# EasyEDA schematic Dashlight.json
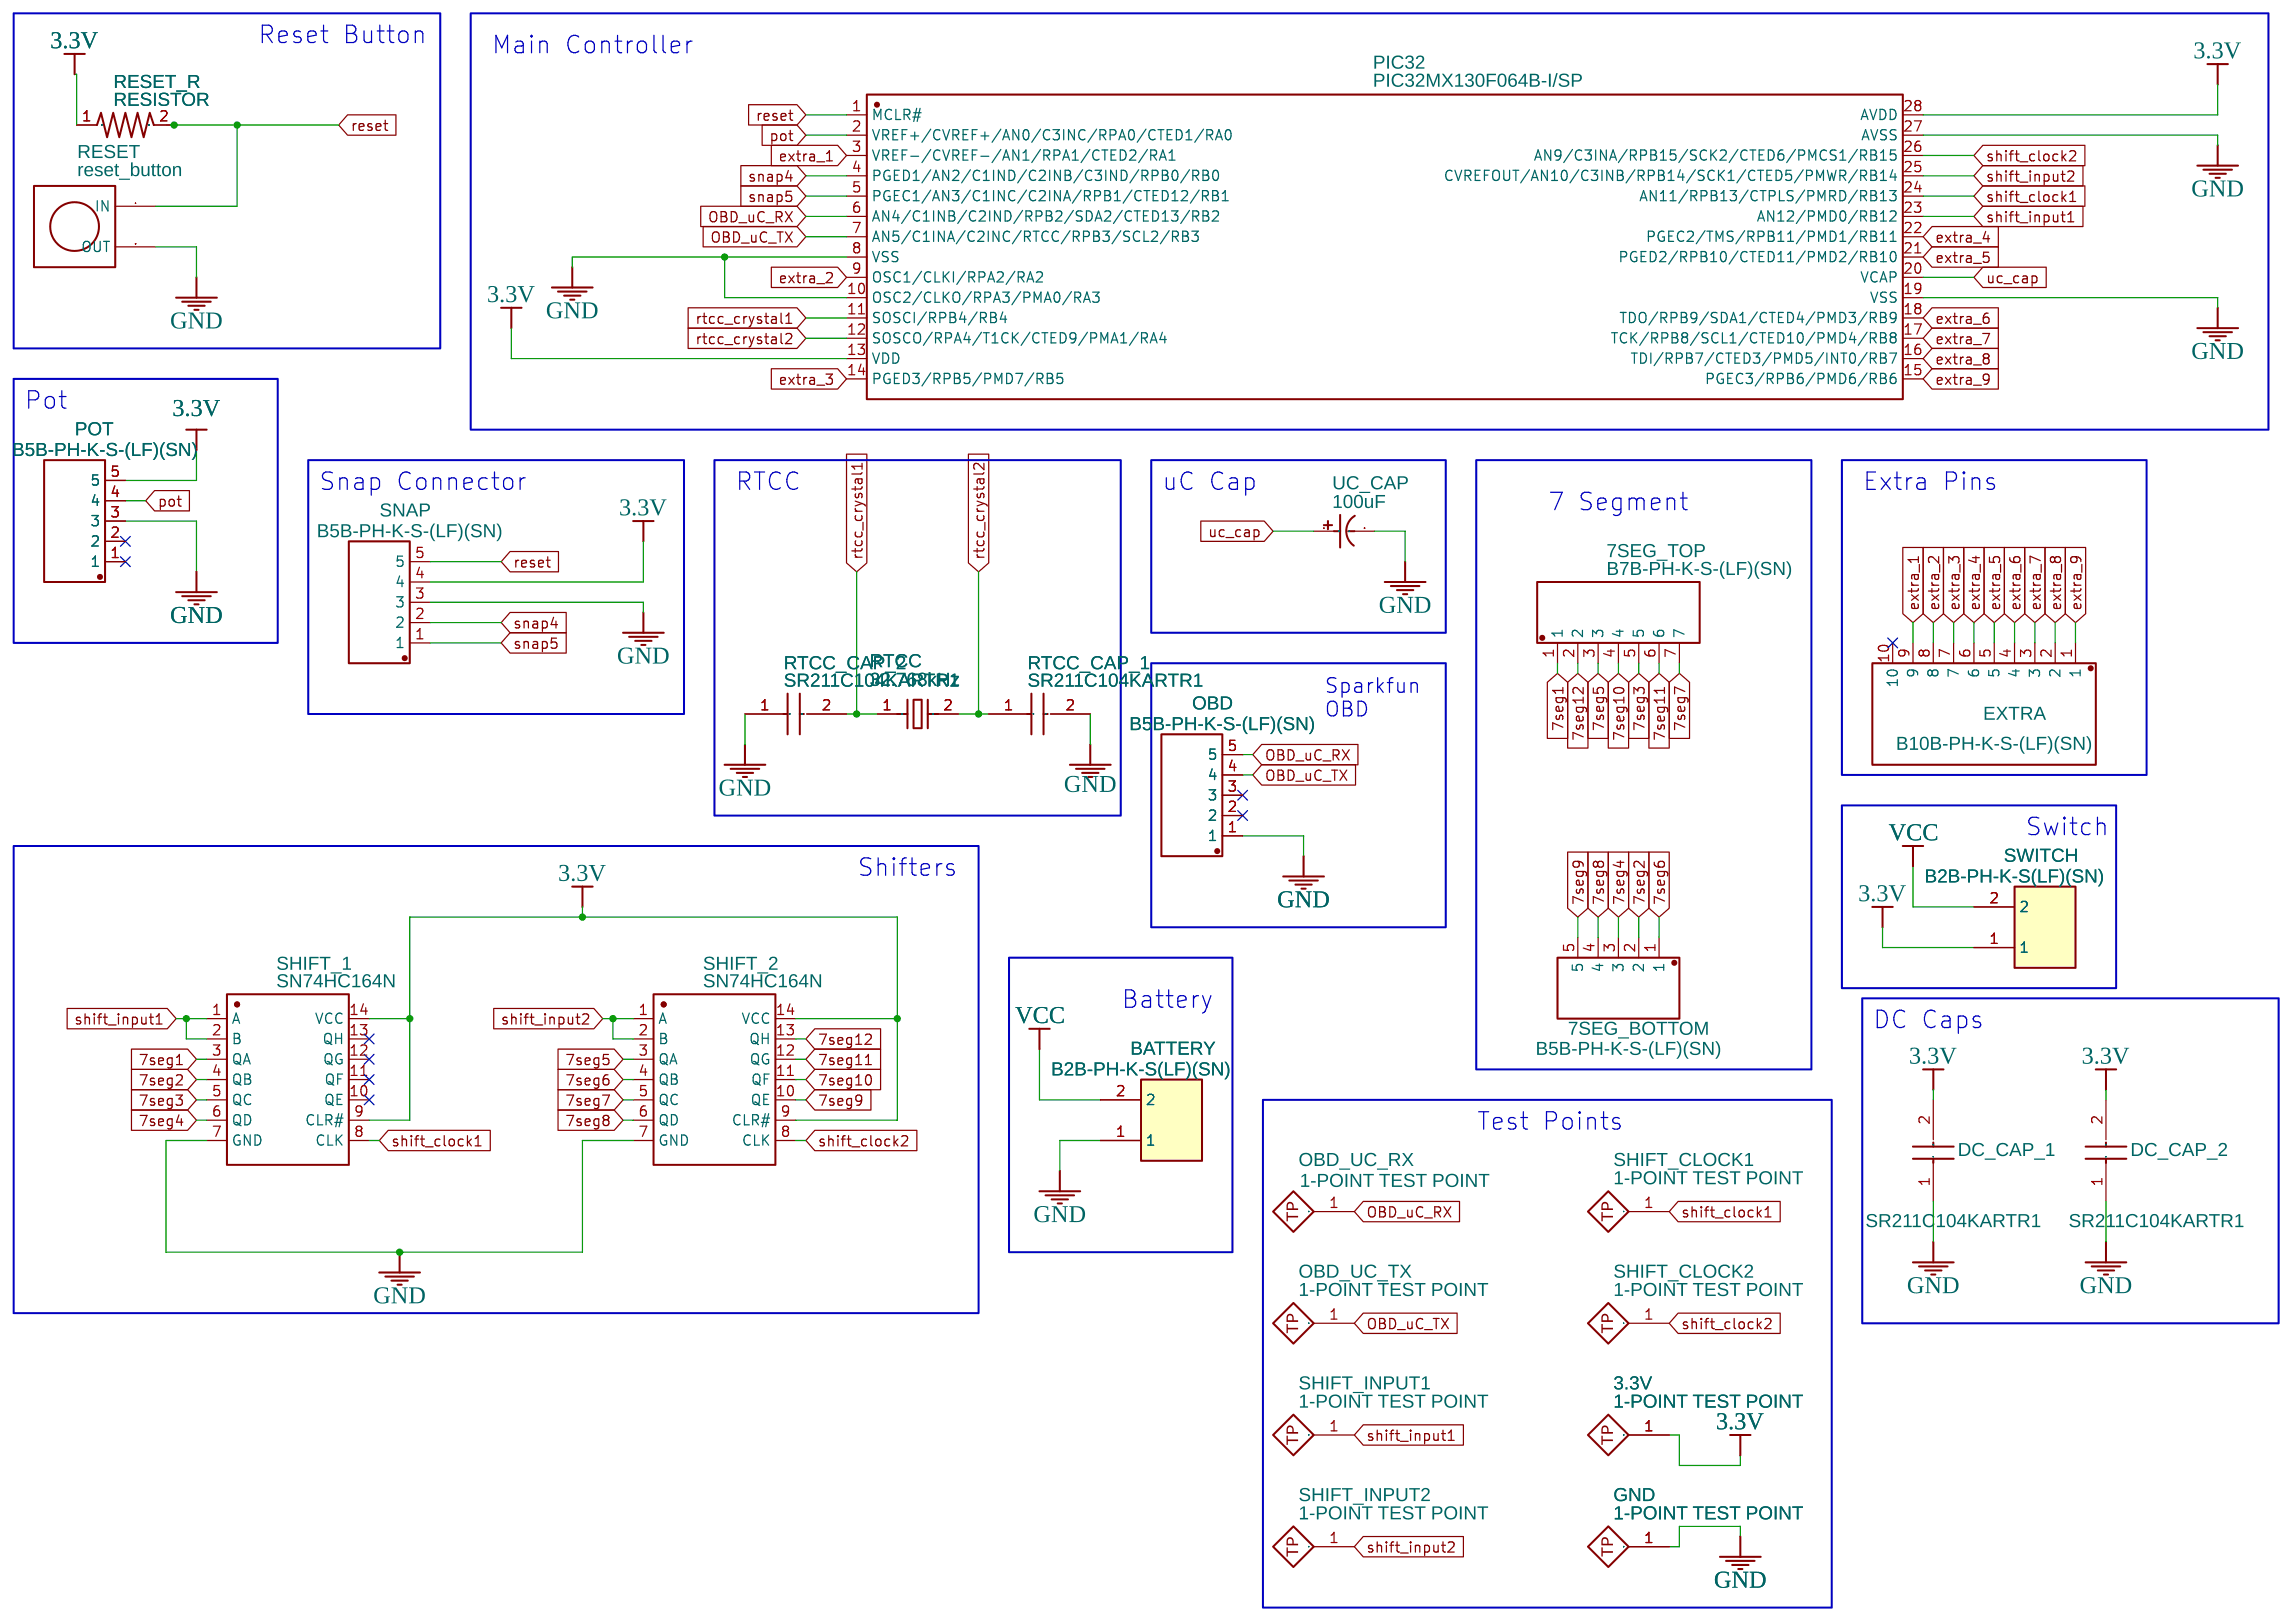
[diagram p0: schematic sheet]

## Parts
3.3V  1-POINT TEST POINT  [1-POINT_TEST-POINT]
7SEG_BOTTOM  B5B-PH-K-S-(LF)(SN)  [CONN-TH_B5B-PH-K-S-LF-SN]
7SEG_TOP  B7B-PH-K-S-(LF)(SN)  [CONN-TH_B7B-PH-K-S-LF-SN]
BATTERY  B2B-PH-K-S(LF)(SN)  [CONN-TH_B2B-PH-K-S]
DC_CAP_1  SR211C104KARTR1  [SR211C104KARTR1]
DC_CAP_2  SR211C104KARTR1  [SR211C104KARTR1]
EXTRA  B10B-PH-K-S-(LF)(SN)  [CONN-TH_B10B-PH-K-S-LF-SN]
GND  1-POINT TEST POINT  [1-POINT_TEST-POINT]
OBD  B5B-PH-K-S-(LF)(SN)  [CONN-TH_B5B-PH-K-S-LF-SN]
OBD_UC_RX  1-POINT TEST POINT  [1-POINT_TEST-POINT]
OBD_UC_TX  1-POINT TEST POINT  [1-POINT_TEST-POINT]
PIC32  PIC32MX130F064B-I/SP  [SPDIP-28_L34.7-W7.2-P2.54-LS7.9-BL]
POT  B5B-PH-K-S-(LF)(SN)  [CONN-TH_B5B-PH-K-S-LF-SN]
RESET  reset_button  [THROUGH-HOLE 6X6MM PUSH BUTTON]
RESET_R  RESISTOR  [RESISTOR THROUGH-HOLE]
RTCC  32.768kHz  [CRYSTAL-TH_BD3.1-L8.0-P1.10-D0.3]
RTCC_CAP_1  SR211C104KARTR1  [SR211C104KARTR1]
RTCC_CAP_2  SR211C104KARTR1  [SR211C104KARTR1]
SHIFT_1  SN74HC164N  [DIP-14_L20.0-W7.6-P2.54-LS8.0-BL]
SHIFT_2  SN74HC164N  [DIP-14_L20.0-W7.6-P2.54-LS8.0-BL]
SHIFT_CLOCK1  1-POINT TEST POINT  [1-POINT_TEST-POINT]
SHIFT_CLOCK2  1-POINT TEST POINT  [1-POINT_TEST-POINT]
SHIFT_INPUT1  1-POINT TEST POINT  [1-POINT_TEST-POINT]
SHIFT_INPUT2  1-POINT TEST POINT  [1-POINT_TEST-POINT]
SNAP  B5B-PH-K-S-(LF)(SN)  [CONN-TH_B5B-PH-K-S-LF-SN]
SWITCH  B2B-PH-K-S(LF)(SN)  [CONN-TH_B2B-PH-K-S]
UC_CAP  100uF  [100UF (THROUGH HOLE) CP]

## Library data of the parts
3.3V GND OBD_UC_RX OBD_UC_TX SHIFT_CLOCK1 SHIFT_CLOCK2 SHIFT_INPUT1 SHIFT_INPUT2 = 1-POINT TEST POINT: Contributor: ahsan2
7SEG_BOTTOM OBD POT SNAP = B5B-PH-K-S-(LF)(SN): Contributor: LCSC; Supplier: LCSC; Supplier Part: C157993; Manufacturer: JST; Manufacturer Part: B5B-PH-K-S(LF)(SN); JLCPCB Part Class: Extended Part
7SEG_TOP = B7B-PH-K-S-(LF)(SN): Contributor: LCSC; Supplier: LCSC; Supplier Part: C157981; Manufacturer: JST; Manufacturer Part: B7B-PH-K-S(LF)(SN); JLCPCB Part Class: Extended Part
BATTERY SWITCH = B2B-PH-K-S(LF)(SN): Contributor: LCSC; Supplier: LCSC; Manufacturer: JST; Supplier Part: C131337; JLCPCB Part Class: Extended Part
DC_CAP_1 DC_CAP_2 RTCC_CAP_1 RTCC_CAP_2 = SR211C104KARTR1: Contributor: prestigeJ
EXTRA = B10B-PH-K-S-(LF)(SN): Contributor: LCSC; Supplier: LCSC; Supplier Part: C158038; Manufacturer: JST; Manufacturer Part: B10B-PH-K-S(LF)(SN); JLCPCB Part Class: Extended Part
PIC32 = PIC32MX130F064B-I/SP: Contributor: LCSC; Supplier: LCSC; Supplier Part: C643652; Manufacturer: Microchip Tech; JLCPCB Part Class: Extended Part
RESET = Through-Hole 6x6mm Push Button: Contributor: barreraa1599; Convert to PCB: Yes; Add into BOM: Yes
RESET_R = res: Contributor: Saepul Hidayat
RTCC = MP4032K76812002: Supplier: LCSC; Supplier Part: C17702402; Manufacturer: HUAXIN(华昕); Manufacturer Part: MP2032K76812002; Contributor: lcsc
SHIFT_1 SHIFT_2 = SN74HC164N: Supplier: LCSC; Manufacturer: TI(德州仪器); Supplier Part: C2908; JLCPCB Part Class: Extended Part
UC_CAP = 100uF: Voltage: 10V; Supplier Part: C43314; Supplier: LCSC; Manufacturer: LCSC; Manufacturer Part: 100uF 10V 4*7

## Nets
3.3V: 3.3V.1 DC_CAP_1.2 DC_CAP_2.2 PIC32.13(VDD) PIC32.28(AVDD) POT.5 RESET_R.1 SHIFT_1.9(CLR#) SHIFT_1.14(VCC) SHIFT_2.9(CLR#) SHIFT_2.14(VCC) SNAP.4 SWITCH.1
GND: BATTERY.1 DC_CAP_1.1 DC_CAP_2.1 GND.1 OBD.1 PIC32.8(VSS) PIC32.10(OSC2/CLKO/RPA3/PMA0/RA3) PIC32.19(VSS) PIC32.27(AVSS) POT.3 RESET.2(OUT) RTCC_CAP_1.2 RTCC_CAP_2.1 SHIFT_1.7(GND) SHIFT_2.7(GND) SNAP.3 UC_CAP.2
VCC: BATTERY.2 SWITCH.2
7seg1: 7SEG_TOP.1 SHIFT_1.3(QA)
7seg2: 7SEG_BOTTOM.2 SHIFT_1.4(QB)
7seg3: 7SEG_TOP.5 SHIFT_1.5(QC)
7seg4: 7SEG_BOTTOM.3 SHIFT_1.6(QD)
7seg5: 7SEG_TOP.3 SHIFT_2.3(QA)
7seg6: 7SEG_BOTTOM.1 SHIFT_2.4(QB)
7seg7: 7SEG_TOP.7 SHIFT_2.5(QC)
7seg8: 7SEG_BOTTOM.4 SHIFT_2.6(QD)
7seg9: 7SEG_BOTTOM.5 SHIFT_2.10(QE)
7seg10: 7SEG_TOP.4 SHIFT_2.11(QF)
7seg11: 7SEG_TOP.6 SHIFT_2.12(QG)
7seg12: 7SEG_TOP.2 SHIFT_2.13(QH)
extra_1: EXTRA.9 PIC32.3(VREF-/CVREF-/AN1/RPA1/CTED2/RA1)
extra_2: EXTRA.8 PIC32.9(OSC1/CLKI/RPA2/RA2)
extra_3: EXTRA.7 PIC32.14(PGED3/RPB5/PMD7/RB5)
extra_4: EXTRA.6 PIC32.22(PGEC2/TMS/RPB11/PMD1/RB11)
extra_5: EXTRA.5 PIC32.21(PGED2/RPB10/CTED11/PMD2/RB10)
extra_6: EXTRA.4 PIC32.18(TDO/RPB9/SDA1/CTED4/PMD3/RB9)
extra_7: EXTRA.3 PIC32.17(TCK/RPB8/SCL1/CTED10/PMD4/RB8)
extra_8: EXTRA.2 PIC32.16(TDI/RPB7/CTED3/PMD5/INT0/RB7)
extra_9: EXTRA.1 PIC32.15(PGEC3/RPB6/PMD6/RB6)
OBD_uC_RX: OBD.5 OBD_UC_RX.1 PIC32.6(AN4/C1INB/C2IND/RPB2/SDA2/CTED13/RB2)
OBD_uC_TX: OBD.4 OBD_UC_TX.1 PIC32.7(AN5/C1INA/C2INC/RTCC/RPB3/SCL2/RB3)
pot: PIC32.2(VREF+/CVREF+/AN0/C3INC/RPA0/CTED1/RA0) POT.4
reset: PIC32.1(MCLR#) RESET.1(IN) RESET_R.2 SNAP.5
rtcc_crystal1: PIC32.11(SOSCI/RPB4/RB4) RTCC.1 RTCC_CAP_2.2
rtcc_crystal2: PIC32.12(SOSCO/RPA4/T1CK/CTED9/PMA1/RA4) RTCC.2 RTCC_CAP_1.1
shift_clock1: PIC32.24(AN11/RPB13/CTPLS/PMRD/RB13) SHIFT_1.8(CLK) SHIFT_CLOCK1.1
shift_clock2: PIC32.26(AN9/C3INA/RPB15/SCK2/CTED6/PMCS1/RB15) SHIFT_2.8(CLK) SHIFT_CLOCK2.1
shift_input1: PIC32.23(AN12/PMD0/RB12) SHIFT_1.1(A) SHIFT_1.2(B) SHIFT_INPUT1.1
shift_input2: PIC32.25(CVREFOUT/AN10/C3INB/RPB14/SCK1/CTED5/PMWR/RB14) SHIFT_2.1(A) SHIFT_2.2(B) SHIFT_INPUT2.1
snap4: PIC32.4(PGED1/AN2/C1IND/C2INB/C3IND/RPB0/RB0) SNAP.2
snap5: PIC32.5(PGEC1/AN3/C1INC/C2INA/RPB1/CTED12/RB1) SNAP.1
uc_cap: PIC32.20(VCAP) UC_CAP.1

Not connected (* = marked no-connect by the designer): EXTRA 10*; OBD 2* 3*; POT 1* 2*; SHIFT_1 10(QE)* 11(QF)* 12(QG)* 13(QH)*

## Notes on the sheet
- Reset Button
- Main Controller
- Pot
- Snap Connector
- RTCC
- uC Cap
- Extra Pins
- 7 Segment
- Sparkfun
  OBD
- Switch
- Shifters
- Battery
- DC Caps
- Test Points
